# Altium schematic sheet Sheet1.SchDoc
size D
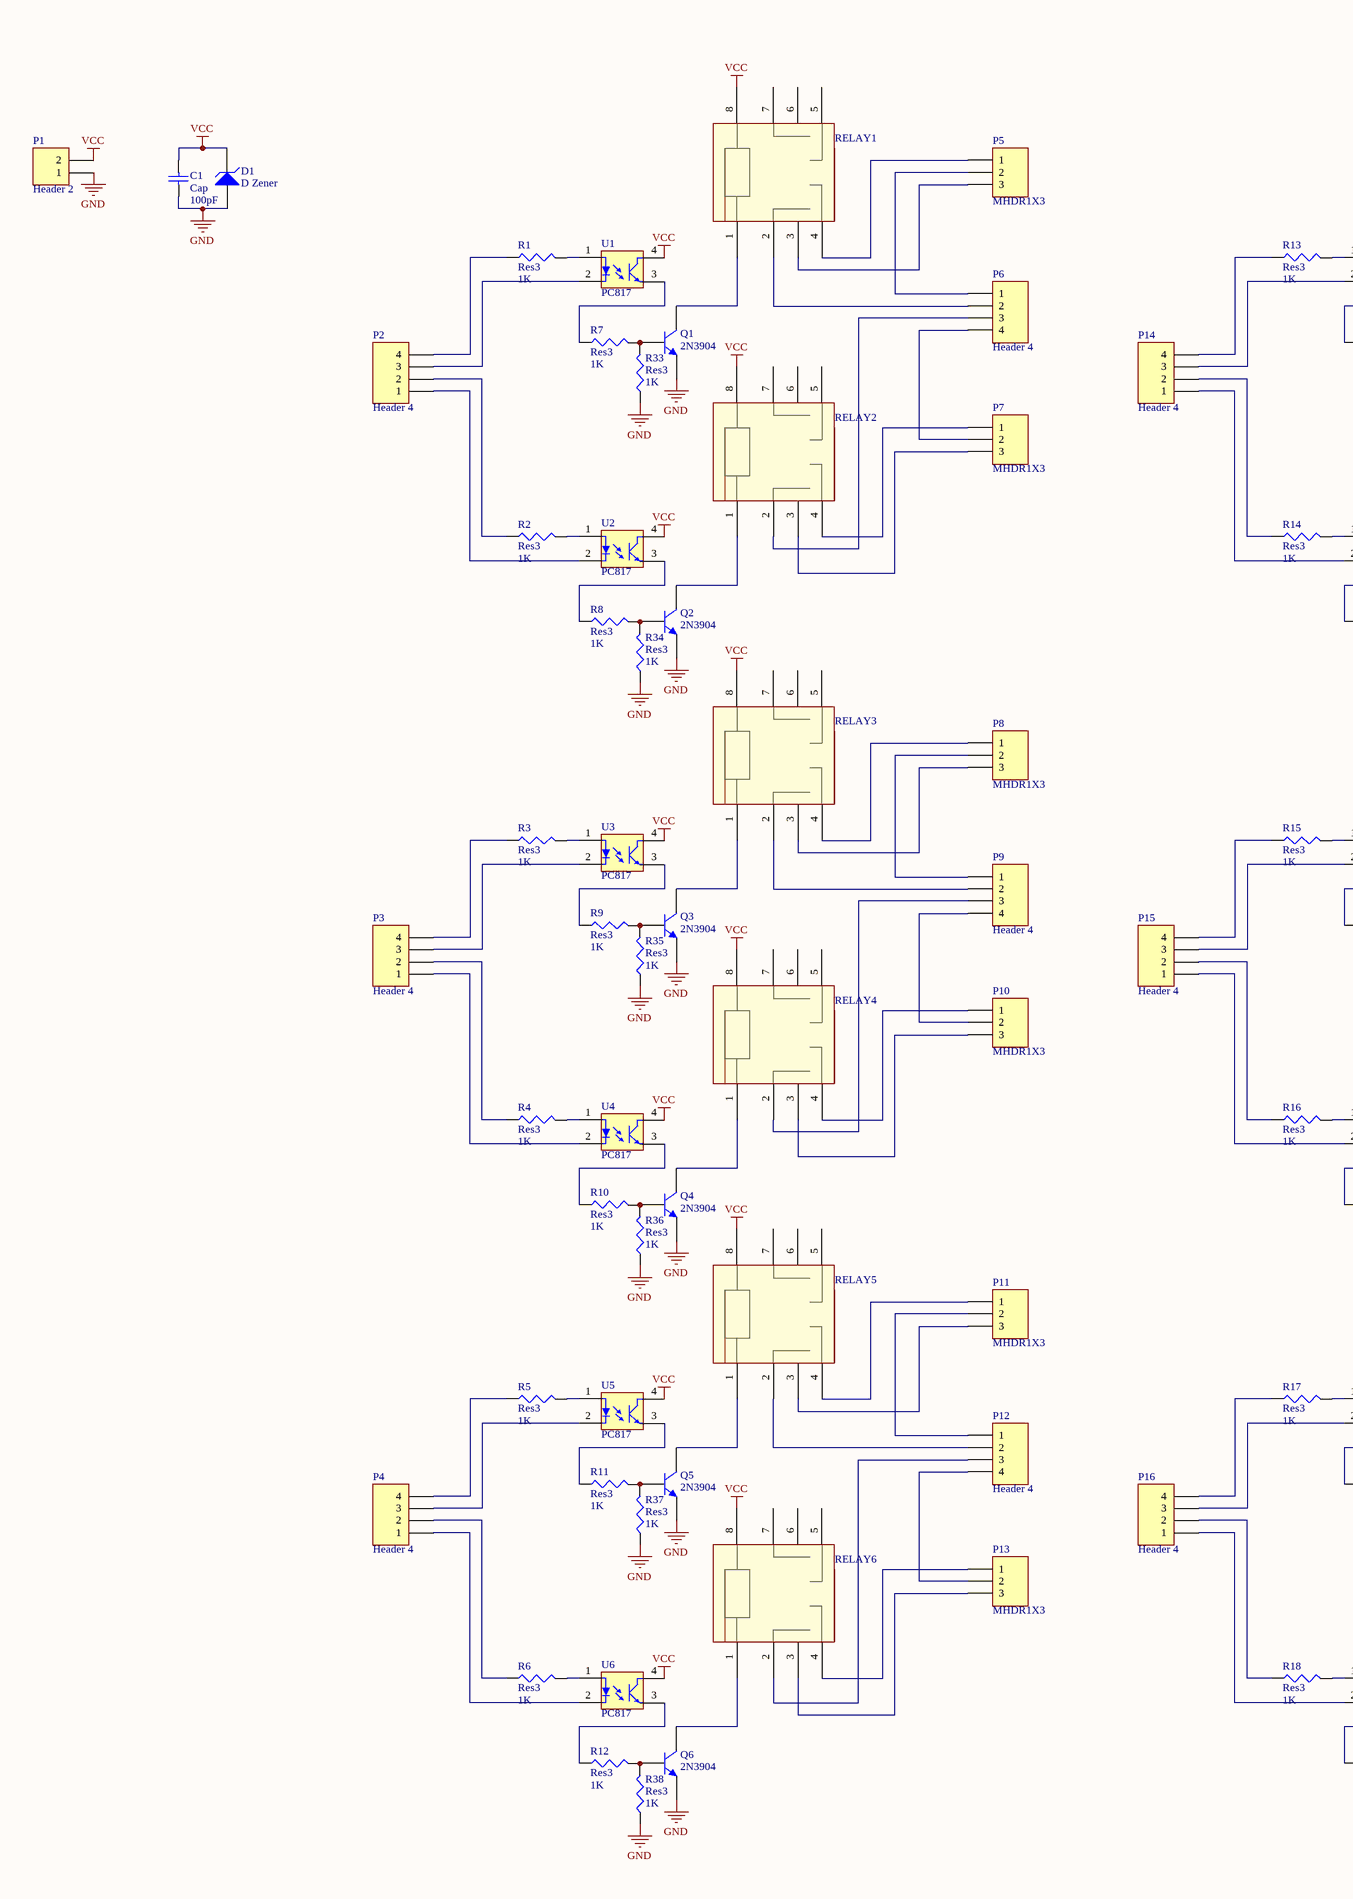
[diagram p0: Sheet1.SchDoc, left]
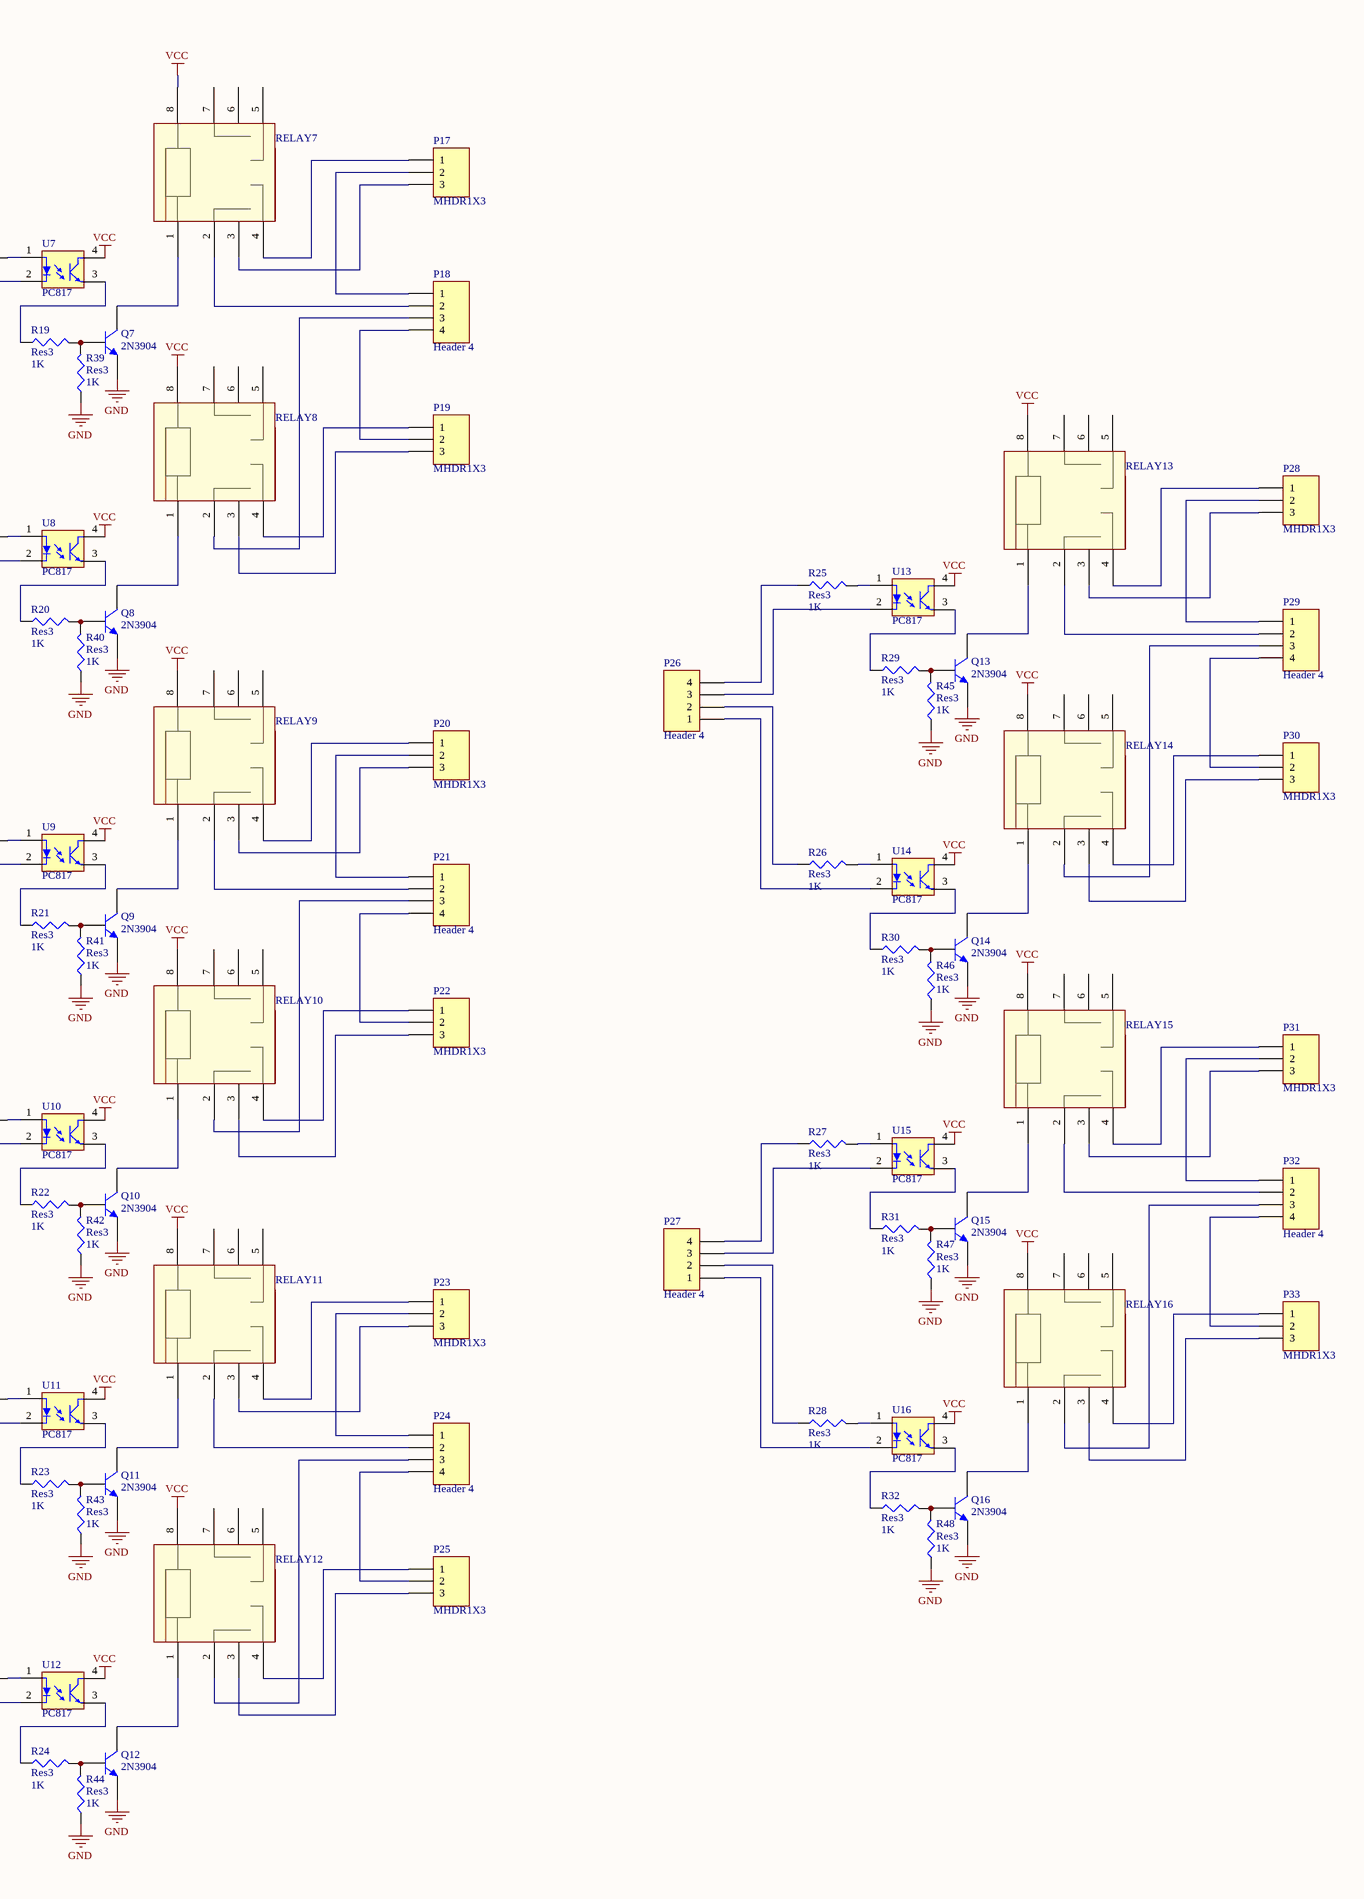
[diagram p1: Sheet1.SchDoc, right]

## Parts
C1  Cap  value 100pF  [RAD-0.3]
D1  D Zener  [DIODE-0.7]
P1  Header 2  [CON2]
P2  Header 4  [CON4]
P3  Header 4  [CON4]
P4  Header 4  [CON4]
P5  MHDR1X3  [MHDR1X3]
P6  Header 4  [CON4]
P7  MHDR1X3  [MHDR1X3]
P8  MHDR1X3  [MHDR1X3]
P9  Header 4  [CON4]
P10  MHDR1X3  [MHDR1X3]
P11  MHDR1X3  [MHDR1X3]
P12  Header 4  [CON4]
P13  MHDR1X3  [MHDR1X3]
P14  Header 4  [CON4]
P15  Header 4  [CON4]
P16  Header 4  [CON4]
P17  MHDR1X3  [MHDR1X3]
P18  Header 4  [CON4]
P19  MHDR1X3  [MHDR1X3]
P20  MHDR1X3  [MHDR1X3]
P21  Header 4  [CON4]
P22  MHDR1X3  [MHDR1X3]
P23  MHDR1X3  [MHDR1X3]
P24  Header 4  [CON4]
P25  MHDR1X3  [MHDR1X3]
P26  Header 4  [CON4]
P27  Header 4  [CON4]
P28  MHDR1X3  [MHDR1X3]
P29  Header 4  [CON4]
P30  MHDR1X3  [MHDR1X3]
P31  MHDR1X3  [MHDR1X3]
P32  Header 4  [CON4]
P33  MHDR1X3  [MHDR1X3]
Q1  2N3904  [QTO-92]
Q2  2N3904  [QTO-92]
Q3  2N3904  [QTO-92]
Q4  2N3904  [QTO-92]
Q5  2N3904  [QTO-92]
Q6  2N3904  [QTO-92]
Q7  2N3904  [QTO-92]
Q8  2N3904  [QTO-92]
Q9  2N3904  [QTO-92]
Q10  2N3904  [QTO-92]
Q11  2N3904  [QTO-92]
Q12  2N3904  [QTO-92]
Q13  2N3904  [QTO-92]
Q14  2N3904  [QTO-92]
Q15  2N3904  [QTO-92]
Q16  2N3904  [QTO-92]
R1  Res3  value 1K  [C0805]
R2  Res3  value 1K  [C0805]
R3  Res3  value 1K  [C0805]
R4  Res3  value 1K  [C0805]
R5  Res3  value 1K  [C0805]
R6  Res3  value 1K  [C0805]
R7  Res3  value 1K  [C0805]
R8  Res3  value 1K  [C0805]
R9  Res3  value 1K  [C0805]
R10  Res3  value 1K  [C0805]
R11  Res3  value 1K  [C0805]
R12  Res3  value 1K  [C0805]
R13  Res3  value 1K  [C0805]
R14  Res3  value 1K  [C0805]
R15  Res3  value 1K  [C0805]
R16  Res3  value 1K  [C0805]
R17  Res3  value 1K  [C0805]
R18  Res3  value 1K  [C0805]
R19  Res3  value 1K  [C0805]
R20  Res3  value 1K  [C0805]
R21  Res3  value 1K  [C0805]
R22  Res3  value 1K  [C0805]
R23  Res3  value 1K  [C0805]
R24  Res3  value 1K  [C0805]
R25  Res3  value 1K  [C0805]
R26  Res3  value 1K  [C0805]
R27  Res3  value 1K  [C0805]
R28  Res3  value 1K  [C0805]
R29  Res3  value 1K  [C0805]
R30  Res3  value 1K  [C0805]
R31  Res3  value 1K  [C0805]
R32  Res3  value 1K  [C0805]
R33  Res3  value 1K  [C0805]
R34  Res3  value 1K  [C0805]
R35  Res3  value 1K  [C0805]
R36  Res3  value 1K  [C0805]
R37  Res3  value 1K  [C0805]
R38  Res3  value 1K  [C0805]
R39  Res3  value 1K  [C0805]
R40  Res3  value 1K  [C0805]
R41  Res3  value 1K  [C0805]
R42  Res3  value 1K  [C0805]
R43  Res3  value 1K  [C0805]
R44  Res3  value 1K  [C0805]
R45  Res3  value 1K  [C0805]
R46  Res3  value 1K  [C0805]
R47  Res3  value 1K  [C0805]
R48  Res3  value 1K  [C0805]
RELAY1  RY12W-K  [RY-Series]  (value not drawn)
RELAY2  RY12W-K  [RY-Series]  (value not drawn)
RELAY3  RY12W-K  [RY-Series]  (value not drawn)
RELAY4  RY12W-K  [RY-Series]  (value not drawn)
RELAY5  RY12W-K  [RY-Series]  (value not drawn)
RELAY6  RY12W-K  [RY-Series]  (value not drawn)
RELAY7  RY12W-K  [RY-Series]  (value not drawn)
RELAY8  RY12W-K  [RY-Series]  (value not drawn)
RELAY9  RY12W-K  [RY-Series]  (value not drawn)
RELAY10  RY12W-K  [RY-Series]  (value not drawn)
RELAY11  RY12W-K  [RY-Series]  (value not drawn)
RELAY12  RY12W-K  [RY-Series]  (value not drawn)
RELAY13  RY12W-K  [RY-Series]  (value not drawn)
RELAY14  RY12W-K  [RY-Series]  (value not drawn)
RELAY15  RY12W-K  [RY-Series]  (value not drawn)
RELAY16  RY12W-K  [RY-Series]  (value not drawn)
U1  value PC817  [DIP4]  (hidden comment: OPTO)
U2  value PC817  [DIP4]  (hidden comment: OPTO)
U3  value PC817  [DIP4]  (hidden comment: OPTO)
U4  value PC817  [DIP4]  (hidden comment: OPTO)
U5  value PC817  [DIP4]  (hidden comment: OPTO)
U6  value PC817  [DIP4]  (hidden comment: OPTO)
U7  value PC817  [DIP4]  (hidden comment: OPTO)
U8  value PC817  [DIP4]  (hidden comment: OPTO)
U9  value PC817  [DIP4]  (hidden comment: OPTO)
U10  value PC817  [DIP4]  (hidden comment: OPTO)
U11  value PC817  [DIP4]  (hidden comment: OPTO)
U12  value PC817  [DIP4]  (hidden comment: OPTO)
U13  value PC817  [DIP4]  (hidden comment: OPTO)
U14  value PC817  [DIP4]  (hidden comment: OPTO)
U15  value PC817  [DIP4]  (hidden comment: OPTO)
U16  value PC817  [DIP4]  (hidden comment: OPTO)

## Nets
GND: C1.1 D1.1(A) P1.1 Q1.1(E) Q2.1(E) Q3.1(E) Q4.1(E) Q5.1(E) Q6.1(E) Q7.1(E) Q8.1(E) Q9.1(E) Q10.1(E) Q11.1(E) Q12.1(E) Q13.1(E) Q14.1(E) Q15.1(E) Q16.1(E) R33.1 R34.1 R35.1 R36.1 R37.1 R38.1 R39.1 R40.1 R41.1 R42.1 R43.1 R44.1 R45.1 R46.1 R47.1 R48.1
VCC: C1.2 D1.2(K) P1.2 RELAY1.8 RELAY2.8 RELAY3.8 RELAY4.8 RELAY5.8 RELAY6.8 RELAY7.8 RELAY8.8 RELAY9.8 RELAY10.8 RELAY11.8 RELAY12.8 RELAY13.8 RELAY14.8 RELAY15.8 RELAY16.8 U1.4(C) U2.4(C) U3.4(C) U4.4(C) U5.4(C) U6.4(C) U7.4(C) U8.4(C) U9.4(C) U10.4(C) U11.4(C) U12.4(C) U13.4(C) U14.4(C) U15.4(C) U16.4(C)
NetP2_1: P2.1 U2.2(C)
NetP2_2: P2.2 R2.1
NetP2_3: P2.3 U1.2(C)
NetP2_4: P2.4 R1.1
NetP3_1: P3.1 U4.2(C)
NetP3_2: P3.2 R4.1
NetP3_3: P3.3 U3.2(C)
NetP3_4: P3.4 R3.1
NetP4_1: P4.1 U6.2(C)
NetP4_2: P4.2 R6.1
NetP4_3: P4.3 U5.2(C)
NetP4_4: P4.4 R5.1
NetP5_1: P5.1 RELAY1.4
NetP5_2: P5.2 P6.1
NetP5_3: P5.3 RELAY1.3
NetP6_2: P6.2 RELAY1.2
NetP6_3: P6.3 RELAY2.2
NetP6_4: P6.4 P7.2
NetP7_1: P7.1 RELAY2.4
NetP7_3: P7.3 RELAY2.3
NetP8_1: P8.1 RELAY3.4
NetP8_2: P8.2 P9.1
NetP8_3: P8.3 RELAY3.3
NetP9_2: P9.2 RELAY3.2
NetP9_3: P9.3 RELAY4.2
NetP9_4: P9.4 P10.2
NetP10_1: P10.1 RELAY4.4
NetP10_3: P10.3 RELAY4.3
NetP11_1: P11.1 RELAY5.4
NetP11_2: P11.2 P12.1
NetP11_3: P11.3 RELAY5.3
NetP12_2: P12.2 RELAY5.2
NetP12_3: P12.3 RELAY6.2
NetP12_4: P12.4 P13.2
NetP13_1: P13.1 RELAY6.4
NetP13_3: P13.3 RELAY6.3
NetP14_1: P14.1 U8.2(C)
NetP14_2: P14.2 R14.1
NetP14_3: P14.3 U7.2(C)
NetP14_4: P14.4 R13.1
NetP15_1: P15.1 U10.2(C)
NetP15_2: P15.2 R16.1
NetP15_3: P15.3 U9.2(C)
NetP15_4: P15.4 R15.1
NetP16_1: P16.1 U12.2(C)
NetP16_2: P16.2 R18.1
NetP16_3: P16.3 U11.2(C)
NetP16_4: P16.4 R17.1
NetP17_1: P17.1 RELAY7.4
NetP17_2: P17.2 P18.1
NetP17_3: P17.3 RELAY7.3
NetP18_2: P18.2 RELAY7.2
NetP18_3: P18.3 RELAY8.2
NetP18_4: P18.4 P19.2
NetP19_1: P19.1 RELAY8.4
NetP19_3: P19.3 RELAY8.3
NetP20_1: P20.1 RELAY9.4
NetP20_2: P20.2 P21.1
NetP20_3: P20.3 RELAY9.3
NetP21_2: P21.2 RELAY9.2
NetP21_3: P21.3 RELAY10.2
NetP21_4: P21.4 P22.2
NetP22_1: P22.1 RELAY10.4
NetP22_3: P22.3 RELAY10.3
NetP23_1: P23.1 RELAY11.4
NetP23_2: P23.2 P24.1
NetP23_3: P23.3 RELAY11.3
NetP24_2: P24.2 RELAY11.2
NetP24_3: P24.3 RELAY12.2
NetP24_4: P24.4 P25.2
NetP25_1: P25.1 RELAY12.4
NetP25_3: P25.3 RELAY12.3
NetP26_1: P26.1 U14.2(C)
NetP26_2: P26.2 R26.1
NetP26_3: P26.3 U13.2(C)
NetP26_4: P26.4 R25.1
NetP27_1: P27.1 U16.2(C)
NetP27_2: P27.2 R28.1
NetP27_3: P27.3 U15.2(C)
NetP27_4: P27.4 R27.1
NetP28_1: P28.1 RELAY13.4
NetP28_2: P28.2 P29.1
NetP28_3: P28.3 RELAY13.3
NetP29_2: P29.2 RELAY13.2
NetP29_3: P29.3 RELAY14.2
NetP29_4: P29.4 P30.2
NetP30_1: P30.1 RELAY14.4
NetP30_3: P30.3 RELAY14.3
NetP31_1: P31.1 RELAY15.4
NetP31_2: P31.2 P32.1
NetP31_3: P31.3 RELAY15.3
NetP32_2: P32.2 RELAY15.2
NetP32_3: P32.3 RELAY16.2
NetP32_4: P32.4 P33.2
NetP33_1: P33.1 RELAY16.4
NetP33_3: P33.3 RELAY16.3
NetQ1_2: Q1.2(C) RELAY1.1
NetQ1_3: Q1.3(B) R7.2 R33.2
NetQ2_2: Q2.2(C) RELAY2.1
NetQ2_3: Q2.3(B) R8.2 R34.2
NetQ3_2: Q3.2(C) RELAY3.1
NetQ3_3: Q3.3(B) R9.2 R35.2
NetQ4_2: Q4.2(C) RELAY4.1
NetQ4_3: Q4.3(B) R10.2 R36.2
NetQ5_2: Q5.2(C) RELAY5.1
NetQ5_3: Q5.3(B) R11.2 R37.2
NetQ6_2: Q6.2(C) RELAY6.1
NetQ6_3: Q6.3(B) R12.2 R38.2
NetQ7_2: Q7.2(C) RELAY7.1
NetQ7_3: Q7.3(B) R19.2 R39.2
NetQ8_2: Q8.2(C) RELAY8.1
NetQ8_3: Q8.3(B) R20.2 R40.2
NetQ9_2: Q9.2(C) RELAY9.1
NetQ9_3: Q9.3(B) R21.2 R41.2
NetQ10_2: Q10.2(C) RELAY10.1
NetQ10_3: Q10.3(B) R22.2 R42.2
NetQ11_2: Q11.2(C) RELAY11.1
NetQ11_3: Q11.3(B) R23.2 R43.2
NetQ12_2: Q12.2(C) RELAY12.1
NetQ12_3: Q12.3(B) R24.2 R44.2
NetQ13_2: Q13.2(C) RELAY13.1
NetQ13_3: Q13.3(B) R29.2 R45.2
NetQ14_2: Q14.2(C) RELAY14.1
NetQ14_3: Q14.3(B) R30.2 R46.2
NetQ15_2: Q15.2(C) RELAY15.1
NetQ15_3: Q15.3(B) R31.2 R47.2
NetQ16_2: Q16.2(C) RELAY16.1
NetQ16_3: Q16.3(B) R32.2 R48.2
NetR1_2: R1.2 U1.1(A)
NetR2_2: R2.2 U2.1(A)
NetR3_2: R3.2 U3.1(A)
NetR4_2: R4.2 U4.1(A)
NetR5_2: R5.2 U5.1(A)
NetR6_2: R6.2 U6.1(A)
NetR7_1: R7.1 U1.3(E)
NetR8_1: R8.1 U2.3(E)
NetR9_1: R9.1 U3.3(E)
NetR10_1: R10.1 U4.3(E)
NetR11_1: R11.1 U5.3(E)
NetR12_1: R12.1 U6.3(E)
NetR13_2: R13.2 U7.1(A)
NetR14_2: R14.2 U8.1(A)
NetR15_2: R15.2 U9.1(A)
NetR16_2: R16.2 U10.1(A)
NetR17_2: R17.2 U11.1(A)
NetR18_2: R18.2 U12.1(A)
NetR19_1: R19.1 U7.3(E)
NetR20_1: R20.1 U8.3(E)
NetR21_1: R21.1 U9.3(E)
NetR22_1: R22.1 U10.3(E)
NetR23_1: R23.1 U11.3(E)
NetR24_1: R24.1 U12.3(E)
NetR25_2: R25.2 U13.1(A)
NetR26_2: R26.2 U14.1(A)
NetR27_2: R27.2 U15.1(A)
NetR28_2: R28.2 U16.1(A)
NetR29_1: R29.1 U13.3(E)
NetR30_1: R30.1 U14.3(E)
NetR31_1: R31.1 U15.3(E)
NetR32_1: R32.1 U16.3(E)

Not connected (* = marked no-connect by the designer): RELAY1 5 6 7; RELAY2 5 6 7; RELAY3 5 6 7; RELAY4 5 6 7; RELAY5 5 6 7; RELAY6 5 6 7; RELAY7 5 6 7; RELAY8 5 6 7; RELAY9 5 6 7; RELAY10 5 6 7; RELAY11 5 6 7; RELAY12 5 6 7; RELAY13 5 6 7; RELAY14 5 6 7; RELAY15 5 6 7; RELAY16 5 6 7

## Library data of the parts
C1 = Cap: Capacitor; Published: 8-Jun-2000; LatestRevisionDate: 17-Jul-2002; LatestRevisionNote: Re-released for DXP Platform.; PackageReference: RAD-0.3; Publisher: Altium Limited; PackageDescription: Radial Cap, Thru-Hole; 2 Leads; 0.3 in Pin Spacing
D1 = D Zener: Zener Diode; Published: 8-Jun-2000; LatestRevisionDate: 17-Jul-2002; LatestRevisionNote: Re-released for DXP Platform.; PackageReference: DIODE-0.7; Publisher: Altium Limited; PackageDescription: Diode, Thru-Hole; 2 Leads; 0.7 in Pin Spacing
P1 = Header 2: Header, 2-Pin; LatestRevisionDate: 17-Jul-2002; LatestRevisionNote: Re-released for DXP Platform.; Publisher: Altium Limited
P2-P4 P6 P9 P12 P14-P16 P18 P21 P24 P26 P27 P29 P32 = Header 4: Header, 4-Pin; LatestRevisionDate: 17-Jul-2002; LatestRevisionNote: Re-released for DXP Platform.; Publisher: Altium Limited
P5 P7 P8 P10 P11 P13 P17 P19 P20 P22 P23 P25 P28 P30 P31 P33 = MHDR1X3: Header, 3-Pin; LatestRevisionDate: 17-Jul-2002; LatestRevisionNote: Re-released for DXP Platform.; Publisher: Altium Limited
Q1-Q16 = 2N3904: NPN General Purpose Amplifier; Published: 8-Jun-2000; LatestRevisionDate: 15-Jan-2003; LatestRevisionNote: PCB Footprint 'BCY-W3/D4.7' replaced; DatasheetVersion: 1997; PackageVersion: Sep-1998; PackageReference: TO-92A; Publisher: Altium Limited; Code_JEDEC: TO-92A; ComponentLink1Description: Manufacturer Link; ComponentLink1URL: http://www.fairchildsemi.com/; ComponentLink2Description: Datasheet; ComponentLink2URL: http://www.fairchildsemi.com/ds/2N%2F2N3904.pdf
R1-R48 = Res3: Resistor; Published: 8-Jun-2000; LatestRevisionDate: 29-May-2009; LatestRevisionNote: IPC-7351 Footprint Added.; PackageReference: J1-0603; Publisher: Altium Limited; PackageDescription: Chip Resistor
U1-U16 = OPTO_PC817